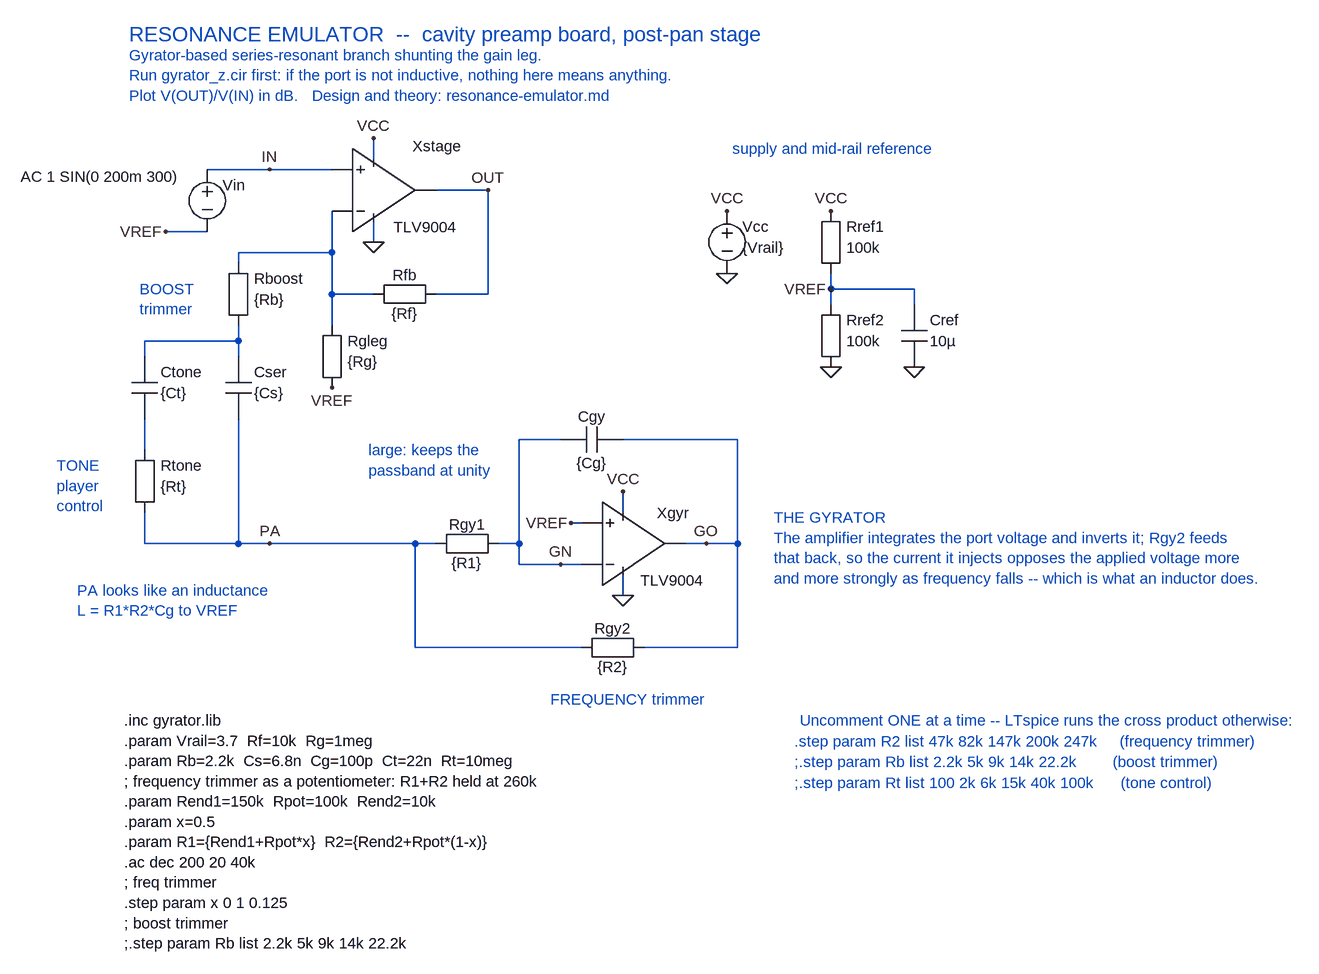
[diagram p0: schematic resonance.asc]
resonance.asc, the LTspice schematic file:
Version 4
SHEET 1 1852 1360
WIRE 304 240 304 208
WIRE 144 256 48 256
WIRE 240 256 144 256
WIRE 480 288 400 288
WIRE 48 352 -16 352
WIRE 304 368 304 336
WIRE 240 384 240 320
WIRE 240 384 96 384
WIRE 96 400 96 384
WIRE 1008 440 1008 416
WIRE 1136 440 1008 440
WIRE 240 448 240 384
WIRE 304 448 240 448
WIRE 480 448 480 288
WIRE 480 448 400 448
WIRE 1008 464 1008 440
WIRE 1136 464 1136 440
WIRE 240 496 240 448
WIRE 96 520 96 496
WIRE 96 520 -48 520
WIRE -48 544 -48 520
WIRE 96 544 96 520
WIRE 592 672 528 672
WIRE 864 672 688 672
WIRE -48 688 -48 640
WIRE 688 784 688 752
WIRE 624 800 608 800
WIRE -48 832 -48 784
WIRE 96 832 96 640
WIRE 96 832 -48 832
WIRE 144 832 96 832
WIRE 368 832 144 832
WIRE 400 832 368 832
WIRE 528 832 528 672
WIRE 528 832 496 832
WIRE 816 832 784 832
WIRE 864 832 864 672
WIRE 864 832 816 832
WIRE 528 864 528 832
WIRE 592 864 528 864
WIRE 624 864 592 864
WIRE 688 912 688 880
WIRE 368 992 368 832
WIRE 624 992 368 992
WIRE 864 992 864 832
WIRE 864 992 720 992
FLAG -16 352 VREF
FLAG 144 256 IN
FLAG 304 208 VCC
FLAG 304 368 0
FLAG 480 288 OUT
FLAG 240 592 VREF
FLAG 144 832 PA
FLAG 608 800 VREF
FLAG 688 752 VCC
FLAG 688 912 0
FLAG 816 832 GO
FLAG 848 320 VCC
FLAG 848 416 0
FLAG 1008 320 VCC
FLAG 1008 560 0
FLAG 1008 440 VREF
FLAG 1136 560 0
FLAG 592 864 GN
SYMBOL zvsrc 48 304 R0
WINDOW 3 -287 -37 Left 2
SYMATTR Value AC 1 SIN(0 200m 300)
SYMATTR InstName Vin
SYMBOL zopamp 320 288 R0
WINDOW 0 44 -68 Left 2
WINDOW 3 15 57 Left 2
SYMATTR InstName Xstage
SYMATTR Value TLV9004
SYMBOL zres 352 448 R270
WINDOW 0 14 0 VTop 2
WINDOW 3 -14 0 VBottom 2
SYMATTR InstName Rfb
SYMATTR Value {Rf}
SYMBOL zres 240 544 R0
SYMATTR InstName Rgleg
SYMATTR Value {Rg}
SYMBOL zres 96 448 R0
SYMATTR InstName Rboost
SYMATTR Value {Rb}
SYMBOL zcap 96 592 R0
SYMATTR InstName Cser
SYMATTR Value {Cs}
SYMBOL zcap -48 592 R0
SYMATTR InstName Ctone
SYMATTR Value {Ct}
SYMBOL zres -48 736 R0
SYMATTR InstName Rtone
SYMATTR Value {Rt}
SYMBOL zres 448 832 R270
WINDOW 0 14 0 VTop 2
WINDOW 3 -14 0 VBottom 2
SYMATTR InstName Rgy1
SYMATTR Value {R1}
SYMBOL zopamp 704 832 R0
WINDOW 0 36 -47 Left 2
WINDOW 3 11 57 Left 2
SYMATTR InstName Xgyr
SYMATTR Value TLV9004
SYMBOL zcap 640 672 R270
WINDOW 0 20 0 VTop 2
WINDOW 3 -20 0 VBottom 2
SYMATTR InstName Cgy
SYMATTR Value {Cg}
SYMBOL zres 672 992 R270
WINDOW 0 14 0 VTop 2
WINDOW 3 -14 0 VBottom 2
SYMATTR InstName Rgy2
SYMATTR Value {R2}
SYMBOL zvsrc 848 368 R0
SYMATTR InstName Vcc
SYMATTR Value {Vrail}
SYMBOL zres 1008 368 R0
SYMATTR InstName Rref1
SYMATTR Value 100k
SYMBOL zres 1008 512 R0
SYMATTR InstName Rref2
SYMATTR Value 100k
SYMBOL zcap 1136 512 R0
SYMATTR InstName Cref
SYMATTR Value 10µ
TEXT -72 48 Left 3 ;RESONANCE EMULATOR  --  cavity preamp board, post-pan stage
TEXT -72 80 Left 2 ;Gyrator-based series-resonant branch shunting the gain leg.\nRun gyrator_z.cir first: if the port is not inductive, nothing here means anything.\nPlot V(OUT)/V(IN) in dB.   Design and theory: resonance-emulator.md
TEXT 296 688 Left 2 ;large: keeps the\npassband at unity
TEXT -56 440 Left 2 ;BOOST\ntrimmer
TEXT -184 712 Left 2 ;TONE\nplayer\ncontrol
TEXT -152 904 Left 2 ;PA looks like an inductance\nL = R1*R2*Cg to VREF
TEXT 576 1072 Left 2 ;FREQUENCY trimmer
TEXT 920 792 Left 2 ;THE GYRATOR\nThe amplifier integrates the port voltage and inverts it; Rgy2 feeds\nthat back, so the current it injects opposes the applied voltage more\nand more strongly as frequency falls -- which is what an inductor does.
TEXT 856 224 Left 2 ;supply and mid-rail reference
TEXT -80 1104 Left 2 !.inc gyrator.lib\n.param Vrail=3.7  Rf=10k  Rg=1meg\n.param Rb=2.2k  Cs=6.8n  Cg=100p  Ct=22n  Rt=10meg\n; frequency trimmer as a potentiometer: R1+R2 held at 260k\n.param Rend1=150k  Rpot=100k  Rend2=10k\n.param x=0.5\n.param R1={Rend1+Rpot*x}  R2={Rend2+Rpot*(1-x)}\n.ac dec 200 20 40k\n; freq trimmer\n.step param x 0 1 0.125\n; boost trimmer\n;.step param Rb list 2.2k 5k 9k 14k 22.2k
TEXT 960 1104 Left 2 ;Uncomment ONE at a time -- LTspice runs the cross product otherwise:
TEXT 952 1136 Left 2 ;.step param R2 list 47k 82k 147k 200k 247k     (frequency trimmer)
TEXT 952 1168 Left 2 ;;.step param Rb list 2.2k 5k 9k 14k 22.2k        (boost trimmer)
TEXT 952 1200 Left 2 ;;.step param Rt list 100 2k 6k 15k 40k 100k      (tone control)

The netlist it stands for:
* resonance.asc
Vin IN VREF AC 1 SIN(0 200m 300)
XXstage IN N001 VCC 0 OUT TLV9004  ; pins In+ In- V+ V- OUT
Rfb N001 OUT {Rf}
Rgleg N001 VREF {Rg}
Rboost N001 N002 {Rb}
Cser N002 PA {Cs}
Ctone N002 N003 {Ct}
Rtone N003 PA {Rt}
Rgy1 PA GN {R1}
XXgyr VREF GN VCC 0 GO TLV9004  ; pins In+ In- V+ V- OUT
Cgy GN GO {Cg}
Rgy2 PA GO {R2}
Vcc VCC 0 {Vrail}
Rref1 VCC VREF 100k
Rref2 VREF 0 100k
Cref VREF 0 10µ
* RESONANCE EMULATOR  --  cavity preamp board, post-pan stage
* Gyrator-based series-resonant branch shunting the gain leg.
* Run gyrator_z.cir first: if the port is not inductive, nothing here means anything.
* Plot V(OUT)/V(IN) in dB.   Design and theory: resonance-emulator.md
* large: keeps the
* passband at unity
* BOOST
* trimmer
* TONE
* player
* control
* PA looks like an inductance
* L = R1*R2*Cg to VREF
* FREQUENCY trimmer
* THE GYRATOR
* The amplifier integrates the port voltage and inverts it; Rgy2 feeds
* that back, so the current it injects opposes the applied voltage more
* and more strongly as frequency falls -- which is what an inductor does.
* supply and mid-rail reference
.inc gyrator.lib
.param Vrail=3.7  Rf=10k  Rg=1meg
.param Rb=2.2k  Cs=6.8n  Cg=100p  Ct=22n  Rt=10meg
; frequency trimmer as a potentiometer: R1+R2 held at 260k
.param Rend1=150k  Rpot=100k  Rend2=10k
.param x=0.5
.param R1={Rend1+Rpot*x}  R2={Rend2+Rpot*(1-x)}
.ac dec 200 20 40k
; freq trimmer
.step param x 0 1 0.125
; boost trimmer
;.step param Rb list 2.2k 5k 9k 14k 22.2k
* Uncomment ONE at a time -- LTspice runs the cross product otherwise:
* .step param R2 list 47k 82k 147k 200k 247k     (frequency trimmer)
* ;.step param Rb list 2.2k 5k 9k 14k 22.2k        (boost trimmer)
* ;.step param Rt list 100 2k 6k 15k 40k 100k      (tone control)
.backanno
.end